# Altium project ISPR_DEOP_2.PrjPcb
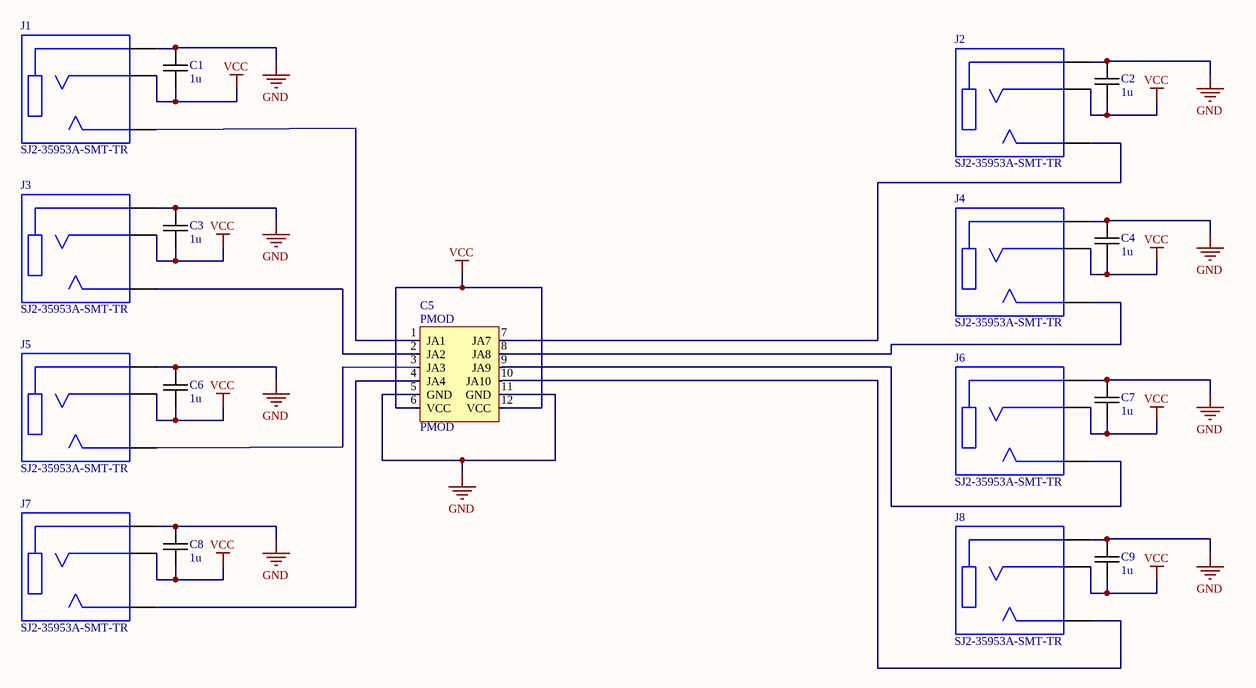
[diagram p0: ConnectorPMOD.SchDoc]
1 sheet, 17 parts. Net scope: global (net labels, ports and power ports of the same name join across sheets).

## Sheet ConnectorPMOD.SchDoc: PCB_Conectores
size A4; Author: Jose Luis Llorente Gonzalez; CompanyName: ETSIT; Organization: UPM; Revision: V1.0

### Parts
C1  1u  [0805C-GENERIC]
C2  1u  [0805C-GENERIC]
C3  1u  [0805C-GENERIC]
C4  1u  [0805C-GENERIC]
C5  PMOD  [PMOD]
C6  1u  [0805C-GENERIC]
C7  1u  [0805C-GENERIC]
C8  1u  [0805C-GENERIC]
C9  1u  [0805C-GENERIC]
J1  SJ2-35953A-SMT-TR  [CUI_SJ2-35953A-SMT-TR]
J2  SJ2-35953A-SMT-TR  [CUI_SJ2-35953A-SMT-TR]
J3  SJ2-35953A-SMT-TR  [CUI_SJ2-35953A-SMT-TR]
J4  SJ2-35953A-SMT-TR  [CUI_SJ2-35953A-SMT-TR]
J5  SJ2-35953A-SMT-TR  [CUI_SJ2-35953A-SMT-TR]
J6  SJ2-35953A-SMT-TR  [CUI_SJ2-35953A-SMT-TR]
J7  SJ2-35953A-SMT-TR  [CUI_SJ2-35953A-SMT-TR]
J8  SJ2-35953A-SMT-TR  [CUI_SJ2-35953A-SMT-TR]

### Nets
GND: C1.1 C2.1 C3.1 C4.1 C5.5(GND) C5.11(GND) C6.1 C7.1 C8.1 C9.1 J1.1(SLEEVE) J2.1(SLEEVE) J3.1(SLEEVE) J4.1(SLEEVE) J5.1(SLEEVE) J6.1(SLEEVE) J7.1(SLEEVE) J8.1(SLEEVE)
VCC: C1.2 C2.2 C3.2 C4.2 C5.6(VCC) C5.12(VCC) C6.2 C7.2 C8.2 C9.2 J1.3(RING1) J2.3(RING1) J3.3(RING1) J4.3(RING1) J5.3(RING1) J6.3(RING1) J7.3(RING1) J8.3(RING1)
NetC5_1: C5.1(JA1) J1.2(TIP)
NetC5_2: C5.2(JA2) J3.2(TIP)
NetC5_3: C5.3(JA3) J5.2(TIP)
NetC5_4: C5.4(JA4) J7.2(TIP)
NetC5_7: C5.7(JA7) J2.2(TIP)
NetC5_8: C5.8(JA8) J4.2(TIP)
NetC5_9: C5.9(JA9) J6.2(TIP)
NetC5_10: C5.10(JA10) J8.2(TIP)

### Notes on the sheet
- Title
- Size:
- Date:
- A4
- Number:
- Time:
- Revision:
- Sheet
- of
- File:

### Library data of the parts
C1-C4 C6-C9 = C0805-GENERIC: GENERIC CAPACITOR NON POLARISED0603
J1-J8 = SJ2-35953A-SMT-TR: 3.5 mm, Stereo, Right Angle, Surface Mount _SMT_, Audio Jack Connector; MF: CUI Devices; Price: None; Availability: Unavailable; SnapEDA_Link: https://www.snapeda.com/parts/SJ2-35953A-SMT-TR/CUI%20Devices/view-part/701771/?ref=snap; MP: SJ2-35953A-SMT-TR; CUI_purchase_URL: https://www.cuidevices.com/product/interconnect/connectors/audio-connectors/jacks/sj2-3595x-smt-series?utm_source=snapeda.com&utm_medium=referral&utm_campaign=snapedaBOM; Value: *; Package: None